# EAGLE design ODGTREF (EAGLE 9.6.0)
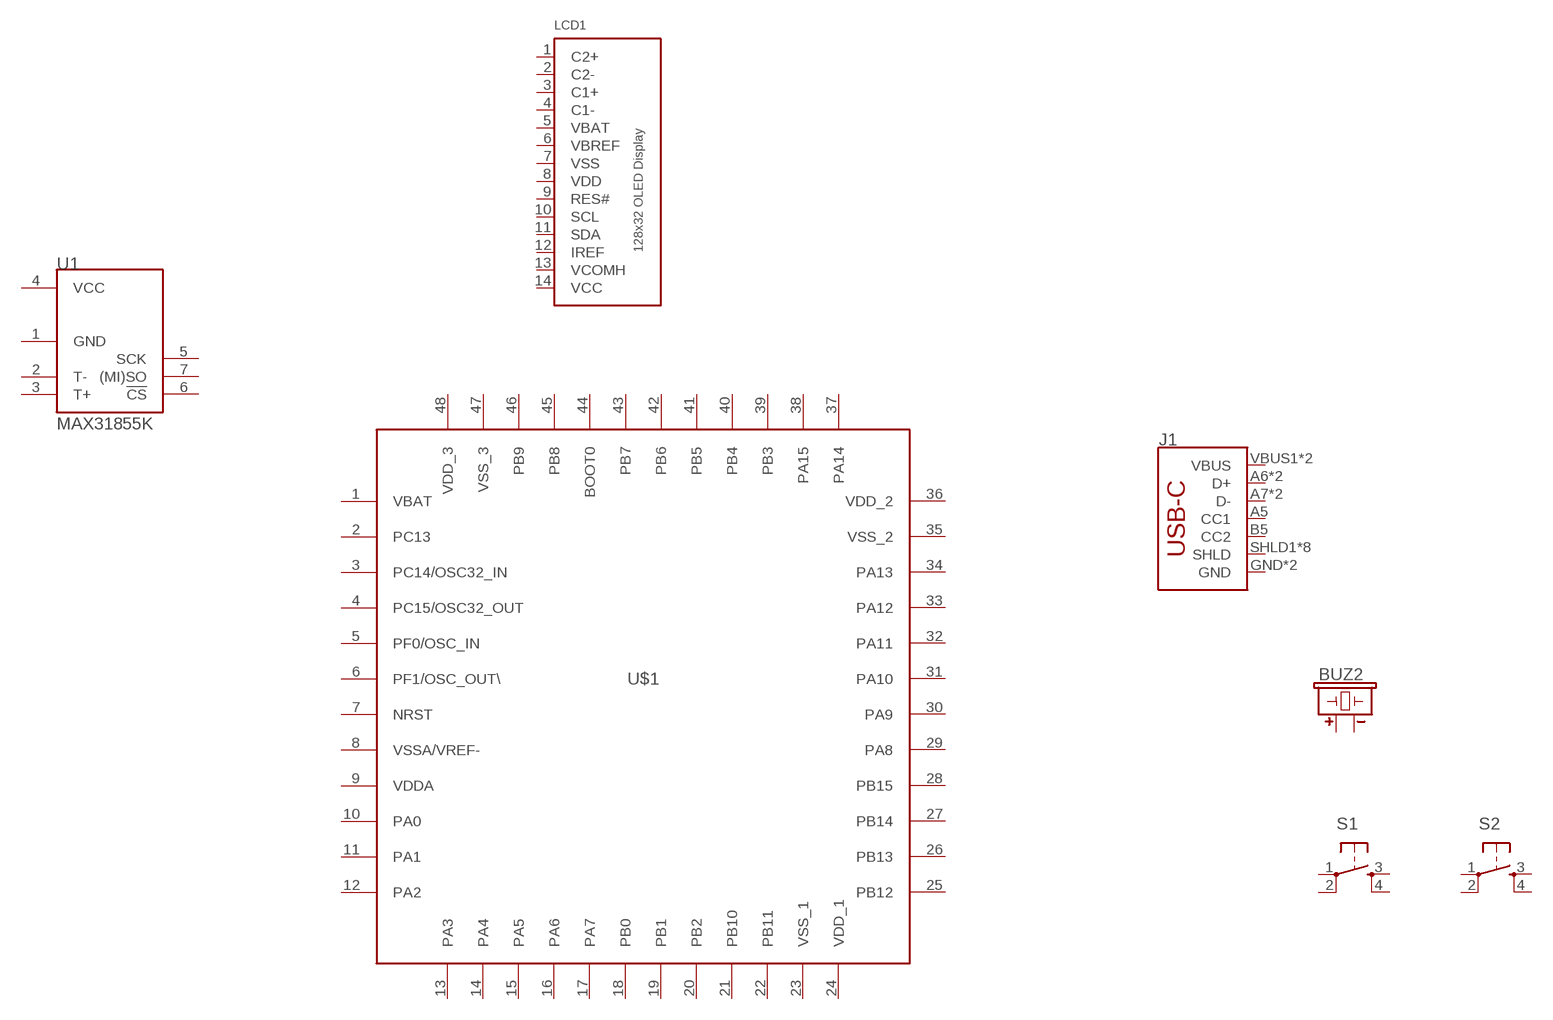
[diagram p0: schematic, sheet 1]

## Parts
BUZ2  BUZZERBUZZER_5020  [BUZZER_5020]
J1  USB_C2-LAYER  [USB-C-16P]
LCD1  0.87INCH_OLED_128X32_SSD1306  [0.87INCH_128X32_OLED_SSD1306]
S1  TAC_SWITCHSMD  [TACTILE_SWITCH_SMD]
S2  TAC_SWITCHSMD  [TACTILE_SWITCH_SMD]
U1  MAX31855K  [SO08]
U$1  STM32F1_LQFP48  [LQFP48]
Unconnected: BUZ2.+(LEAD+) BUZ2.-(LEAD-) J1.A5(CC1) J1.A6(D+) J1.A7(D-) J1.B5(CC2) J1.B6(D+) J1.B7(D-) J1.GND J1.GND2(GND) J1.SHLD1(SHLD) J1.SHLD2(SHLD) J1.SHLD3(SHLD) J1.SHLD4(SHLD) J1.SHLD5(SHLD) J1.SHLD6(SHLD) J1.SHLD7(SHLD) J1.SHLD8(SHLD) J1.VBUS1(VBUS) J1.VBUS2(VBUS) LCD1.1(C2+) LCD1.2(C2-) LCD1.3(C1+) LCD1.4(C1-) LCD1.9(RES#) LCD1.10(SCL) LCD1.11(SDA) LCD1.12(IREF) S1.1 S1.2 S1.3 S1.4 S2.1 S2.2 S2.3 S2.4 U1.1(GND) U1.2(T-) U1.3(T+) U1.4(VCC) U1.5(SCK) U1.6(!CS) U1.7((MI)SO) U$1.1(VBAT) U$1.2(PC13) U$1.3(PC14/OSC32_IN) U$1.4(PC15/OSC32_OUT) U$1.5(PF0/OSC_IN) U$1.6(PF1/OSC_OUT\) U$1.7(NRST) U$1.8(VSSA/VREF-) U$1.9(VDDA) U$1.10(PA0) U$1.11(PA1) U$1.12(PA2) U$1.13(PA3) U$1.14(PA4) U$1.15(PA5) U$1.16(PA6) U$1.17(PA7) U$1.18(PB0) U$1.19(PB1) U$1.20(PB2) U$1.21(PB10) U$1.22(PB11) U$1.23(VSS_1) U$1.24(VDD_1) U$1.25(PB12) U$1.26(PB13) U$1.27(PB14) U$1.28(PB15) U$1.29(PA8) U$1.30(PA9) U$1.31(PA10) U$1.32(PA11) U$1.33(PA12) U$1.34(PA13) U$1.35(VSS_2) U$1.36(VDD_2) U$1.37(PA14) U$1.38(PA15) U$1.39(PB3) U$1.40(PB4) U$1.41(PB5) U$1.42(PB6) U$1.43(PB7) U$1.44(BOOT0) U$1.45(PB8) U$1.46(PB9) U$1.47(VSS_3) U$1.48(VDD_3)

## Power pins joined to a net without a drawn wire
VBAT: LCD1.5(VBAT)
VBREF: LCD1.6(VBREF)
VCC: LCD1.14(VCC)
VCOMH: LCD1.13(VCOMH)
VDD: LCD1.8(VDD)
VSS: LCD1.7(VSS)

## Library data of the parts
BUZ2 = TS100:BUZZER
J1 = SparkFun-Connectors-psa-change-usb-c:USB_C: USB Type C 16Pin Connector Super Speed pins not available on the 16-pin purely SMD connector so this part is best for USB 2.0 implementations. D1 and D2 are tied together enabling D+/- no matter which way the cable is plugged into the connector. The two channel configuration pins (CC1/2) are exposed. These are normally connected to ground via 5.1k resistors but can be reconfigured for high current/high power applications.; PROD_ID: CONN-14122
LCD1 = TS100:0.87INCH_OLED_128X32_SSD1306: 128x32 I2C 0.91" Monochrome OLED Display
S1 S2 = TS100:TAC_SWITCH: Momentary Switch Button commonly used for reset or general input. Spark Fun Electronics SKU : COM-00097
U1 = SparkFun-IC-Conversion:MAX31855K: Cold-Junction-Compensated K-Thermocoupleto-Digital Converter (-270°C to +1800°C) The MAX31855K performs cold-junction compensation and digitizes the signal from a type-K thermocouple. The data is output in a 14-bit resolution, SPI™-compatible, read-only format. This converter resolves temperatures to 0.25°C, allows readings as high as +1800°C and as low as -270°C, and exhibits thermocouple accuracy of ±2°C for temperatures ranging from -200°C to +700°C for K-type thermocouples. Datasheet <https://cdn.sparkfun.com/datasheets/Sensors/Temp/MAX31855K.pdf> SparkFun Products SparkFun Thermocouple Breakout - MAX31855K <https://www.sparkfun.com/products/13266> (SEN-13266); PROD_ID: IC-12578
U$1 = STM32:STM32F1_LQFP48

## Board
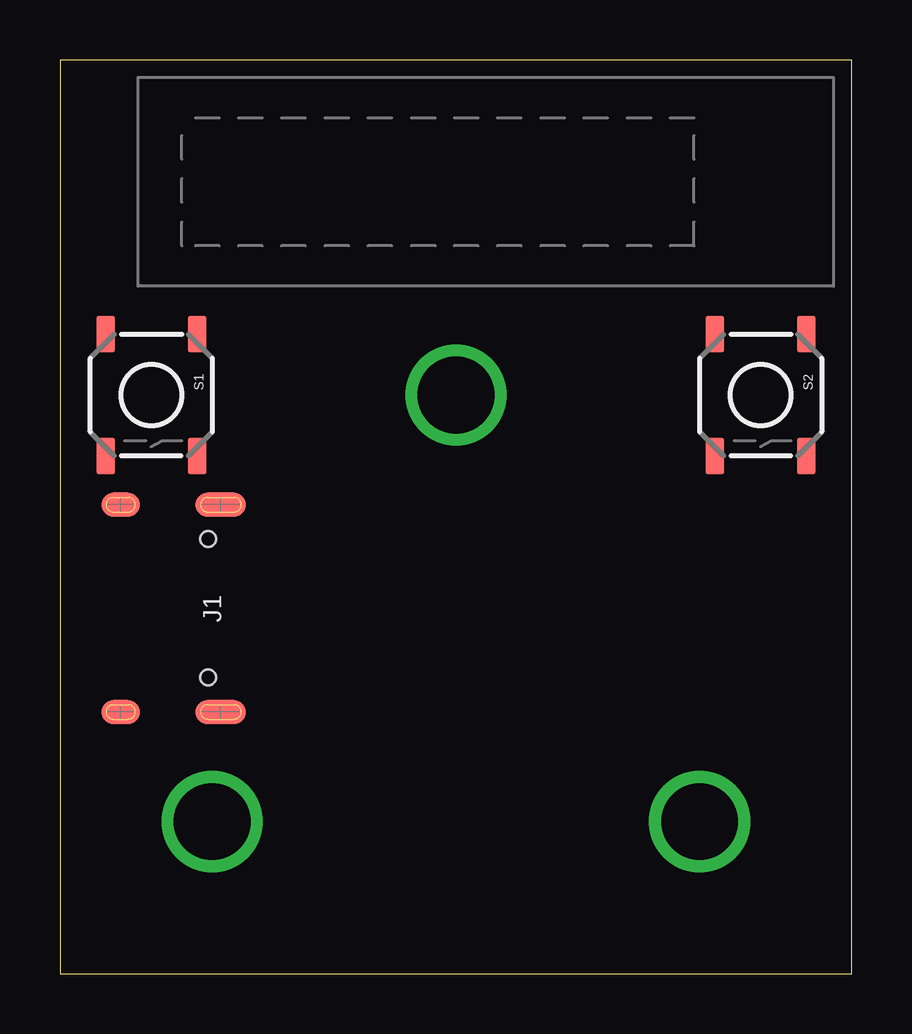
[diagram p1: board, top side]
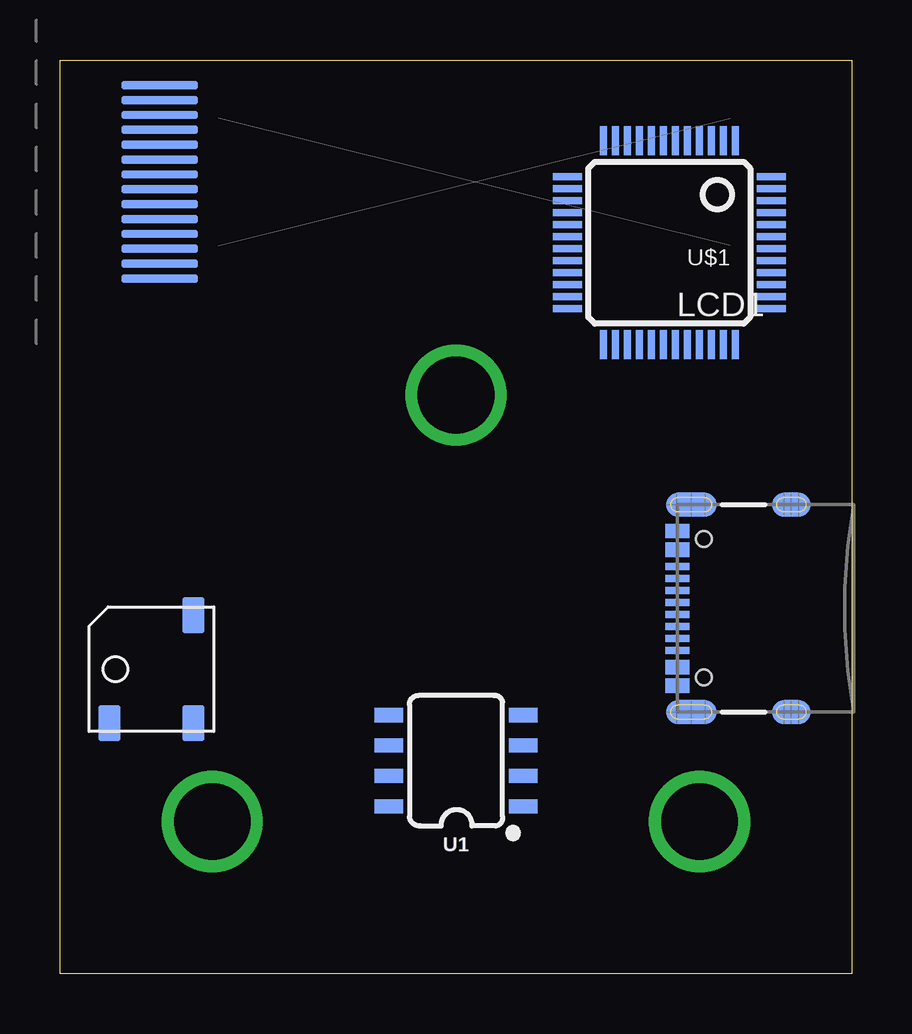
[diagram p2: board, bottom side, seen from below]

Size 33.02 x 38.09 mm. Coordinates in mm from the lower left corner, seen from the top.
Outline: 33.02,38.09 0,38.09 0,0 33.02,0 33.02,38.09
Copper layers (1*16): Top 0.035mm / dielectric 1.5mm / Bottom 0.035mm
Design rules "default": minimum track width 6mil, minimum drill 0.35mm, track to track 6mil, track to pad 6mil, pad to pad 6mil, via to via 6mil, smd to smd 6mil, copper to edge 40mil, drill to drill 6mil, minimum pad ring 10mil, minimum via ring 8mil, stop-mask expansion 4mil, vias tented up to drill 0mil, thermal gap 10mil

### Footprints (pad centres in the part's own frame; a part is rotated, then mirrored left to right if it is on the bottom)
BUZZER_5020 = smd 1.5 x 0.9: + -2.25,-1.75; - 2.25,-1.75; NC -2.25,1.75
USB-C-16P = smd 0.3 x 1: A5 -1.25,-0.34; A6 -0.25,-0.34; A7 0.25,-0.34; A8 1.25,-0.34; B5 1.75,-0.34; B6 0.75,-0.34; B7 -0.75,-0.34; B8 -1.75,-0.34 | smd 0.6 x 1: GND -3.225,-0.34; GND2 3.225,-0.34; VBUS1 -2.45,-0.34; VBUS2 2.45,-0.34 | smd 1 x 2.1: SHLD1 -4.32,-0.915; SHLD2 4.32,-0.915 | smd 1 x 2.1 bottom: SHLD3 -4.32,-0.915; SHLD4 4.32,-0.915 | smd 1 x 1.6: SHLD5 -4.32,-5.095; SHLD8 4.32,-5.095 | smd 1 x 1.6 bottom: SHLD6 -4.32,-5.095; SHLD7 4.32,-5.095 | hole 0.65: -2.89,-1.445; 2.89,-1.445
0.87INCH_128X32_OLED_SSD1306 = smd 3.2 x 0.35: 1 -2.888,-4.03; 2 -2.888,-3.41; 3 -2.888,-2.79; 4 -2.888,-2.17; 5 -2.888,-1.55; 6 -2.888,-0.93; 7 -2.888,-0.31; 8 -2.888,0.31; 9 -2.888,0.93; 10 -2.888,1.55; 11 -2.888,2.17; 12 -2.888,2.79; 13 -2.888,3.41; 14 -2.888,4.03
TACTILE_SWITCH_SMD = smd 1.524 x 0.762: 1 -2.54,1.905; 2 2.54,1.905; 3 -2.54,-1.905; 4 2.54,-1.905
SO08 = smd 0.6 x 1.2: 1 -1.905,-2.8; 2 -0.635,-2.8; 3 0.635,-2.8; 4 1.905,-2.8; 5 1.905,2.8; 6 0.635,2.8; 7 -0.635,2.8; 8 -1.905,2.8
LQFP48 = smd 0.3 x 1.2: 1 -2.75,-4.25; 2 -2.25,-4.25; 3 -1.75,-4.25; 4 -1.25,-4.25; 5 -0.75,-4.25; 6 -0.25,-4.25; 7 0.25,-4.25; 8 0.75,-4.25; 9 1.25,-4.25; 10 1.75,-4.25; 11 2.25,-4.25; 12 2.75,-4.25; 25 2.75,4.25; 26 2.25,4.25; 27 1.75,4.25; 28 1.25,4.25; 29 0.75,4.25; 30 0.25,4.25; 31 -0.25,4.25; 32 -0.75,4.25; 33 -1.25,4.25; 34 -1.75,4.25; 35 -2.25,4.25; 36 -2.75,4.25 | smd 1.2 x 0.3: 13 4.25,-2.75; 14 4.25,-2.25; 15 4.25,-1.75; 16 4.25,-1.25; 17 4.25,-0.75; 18 4.25,-0.25; 19 4.25,0.25; 20 4.25,0.75; 21 4.25,1.25; 22 4.25,1.75; 23 4.25,2.25; 24 4.25,2.75; 37 -4.25,2.75; 38 -4.25,2.25; 39 -4.25,1.75; 40 -4.25,1.25; 41 -4.25,0.75; 42 -4.25,0.25; 43 -4.25,-0.25; 44 -4.25,-0.75; 45 -4.25,-1.25; 46 -4.25,-1.75; 47 -4.25,-2.25; 48 -4.25,-2.75

### Placement (x,y rotation side)
BUZ2  29.21,12.69 90 bottom
J1  7.62,15.23 90 bottom
LCD1  31.75,33.01 180 bottom
S1  3.81,24.12 270 top
S2  29.21,24.12 270 top
U1  16.51,8.88 90 bottom
U$1  7.62,30.47 180 bottom

### Tracks (layer width: path | path; a pad name or v marks a point on that pad's centre or on a via)
N$1  (via drill 3.2)
  other vias: 26.67,6.34
N$2  (via drill 3.2)
  other vias: 6.35,6.34
N$3  (via drill 3.2)
  other vias: 16.51,24.12